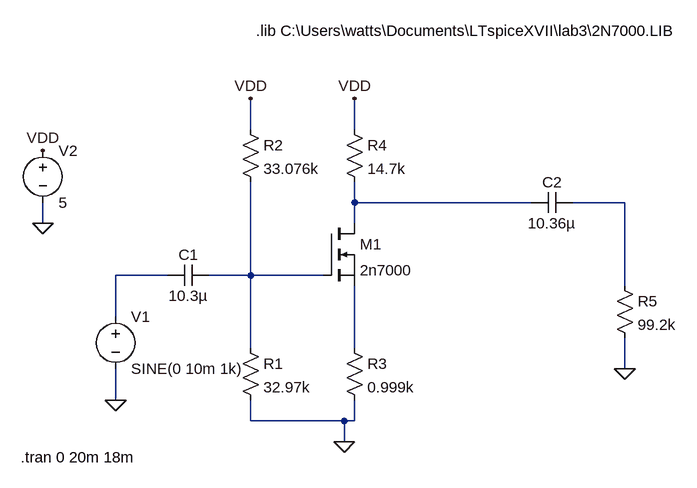
[diagram p0: schematic nmos_amplifier.asc]
nmos_amplifier.asc, the LTspice schematic file:
Version 4
SHEET 1 1024 680
WIRE 16 -48 16 -96
WIRE 176 -48 176 -96
WIRE 176 64 176 32
WIRE 448 64 176 64
WIRE 592 64 512 64
WIRE -304 96 -304 64
WIRE 176 96 176 64
WIRE -112 176 -192 176
WIRE 16 176 16 32
WIRE 16 176 -48 176
WIRE 128 176 16 176
WIRE 592 192 592 64
WIRE -192 240 -192 176
WIRE 16 288 16 176
WIRE 176 288 176 192
WIRE 592 320 592 272
WIRE -192 368 -192 320
WIRE 16 400 16 368
WIRE 160 400 16 400
WIRE 176 400 176 368
WIRE 176 400 160 400
WIRE 160 432 160 400
FLAG -304 96 0
FLAG -192 368 0
FLAG -304 -16 VDD
FLAG 160 432 0
FLAG 592 320 0
FLAG 16 -96 VDD
FLAG 176 -96 VDD
DATAFLAG 16 176 ""
SYMBOL nmos 128 96 R0
SYMATTR InstName M1
SYMATTR Value 2n7000
SYMATTR Prefix X
SYMBOL voltage -192 224 R0
WINDOW 123 0 0 Left 0
WINDOW 39 0 0 Left 0
SYMATTR InstName V1
SYMATTR Value SINE(0 10m 1k)
SYMBOL voltage -304 -32 R0
WINDOW 123 0 0 Left 0
WINDOW 39 0 0 Left 0
SYMATTR InstName V2
SYMATTR Value 5
SYMBOL cap -48 160 R90
WINDOW 0 0 32 VBottom 2
WINDOW 3 32 32 VTop 2
SYMATTR InstName C1
SYMATTR Value 10.3µ
SYMBOL res 0 272 R0
SYMATTR InstName R1
SYMATTR Value 32.97k
SYMBOL res 0 -64 R0
SYMATTR InstName R2
SYMATTR Value 33.076k
SYMBOL res 160 272 R0
SYMATTR InstName R3
SYMATTR Value 0.999k
SYMBOL res 160 -64 R0
SYMATTR InstName R4
SYMATTR Value 14.7k
SYMBOL res 576 176 R0
SYMATTR InstName R5
SYMATTR Value 99.2k
SYMBOL cap 512 48 R90
WINDOW 0 0 32 VBottom 2
WINDOW 3 32 32 VTop 2
SYMATTR InstName C2
SYMATTR Value 10.36µ
TEXT 24 -200 Left 2 !.lib C:\\Users\\watts\\Documents\\LTspiceXVII\\lab3\\2N7000.LIB
TEXT -338 456 Left 2 !.tran 0 20m 18m

The netlist it stands for:
* nmos_amplifier.asc
XM1 N001 N004 N005 2n7000  ; pins D G S
V1 N003 0 SINE(0 10m 1k)
V2 VDD 0 5
C1 N004 N003 10.3µ
R1 N004 0 32.97k
R2 VDD N004 33.076k
R3 N005 0 0.999k
R4 VDD N001 14.7k
R5 N002 0 99.2k
C2 N002 N001 10.36µ
.lib C:\Users\watts\Documents\LTspiceXVII\lab3\2N7000.LIB
.tran 0 20m 18m
.backanno
.end